# EAGLE schematic Rx_Nano_V2-1 (EAGLE 7.7.0)
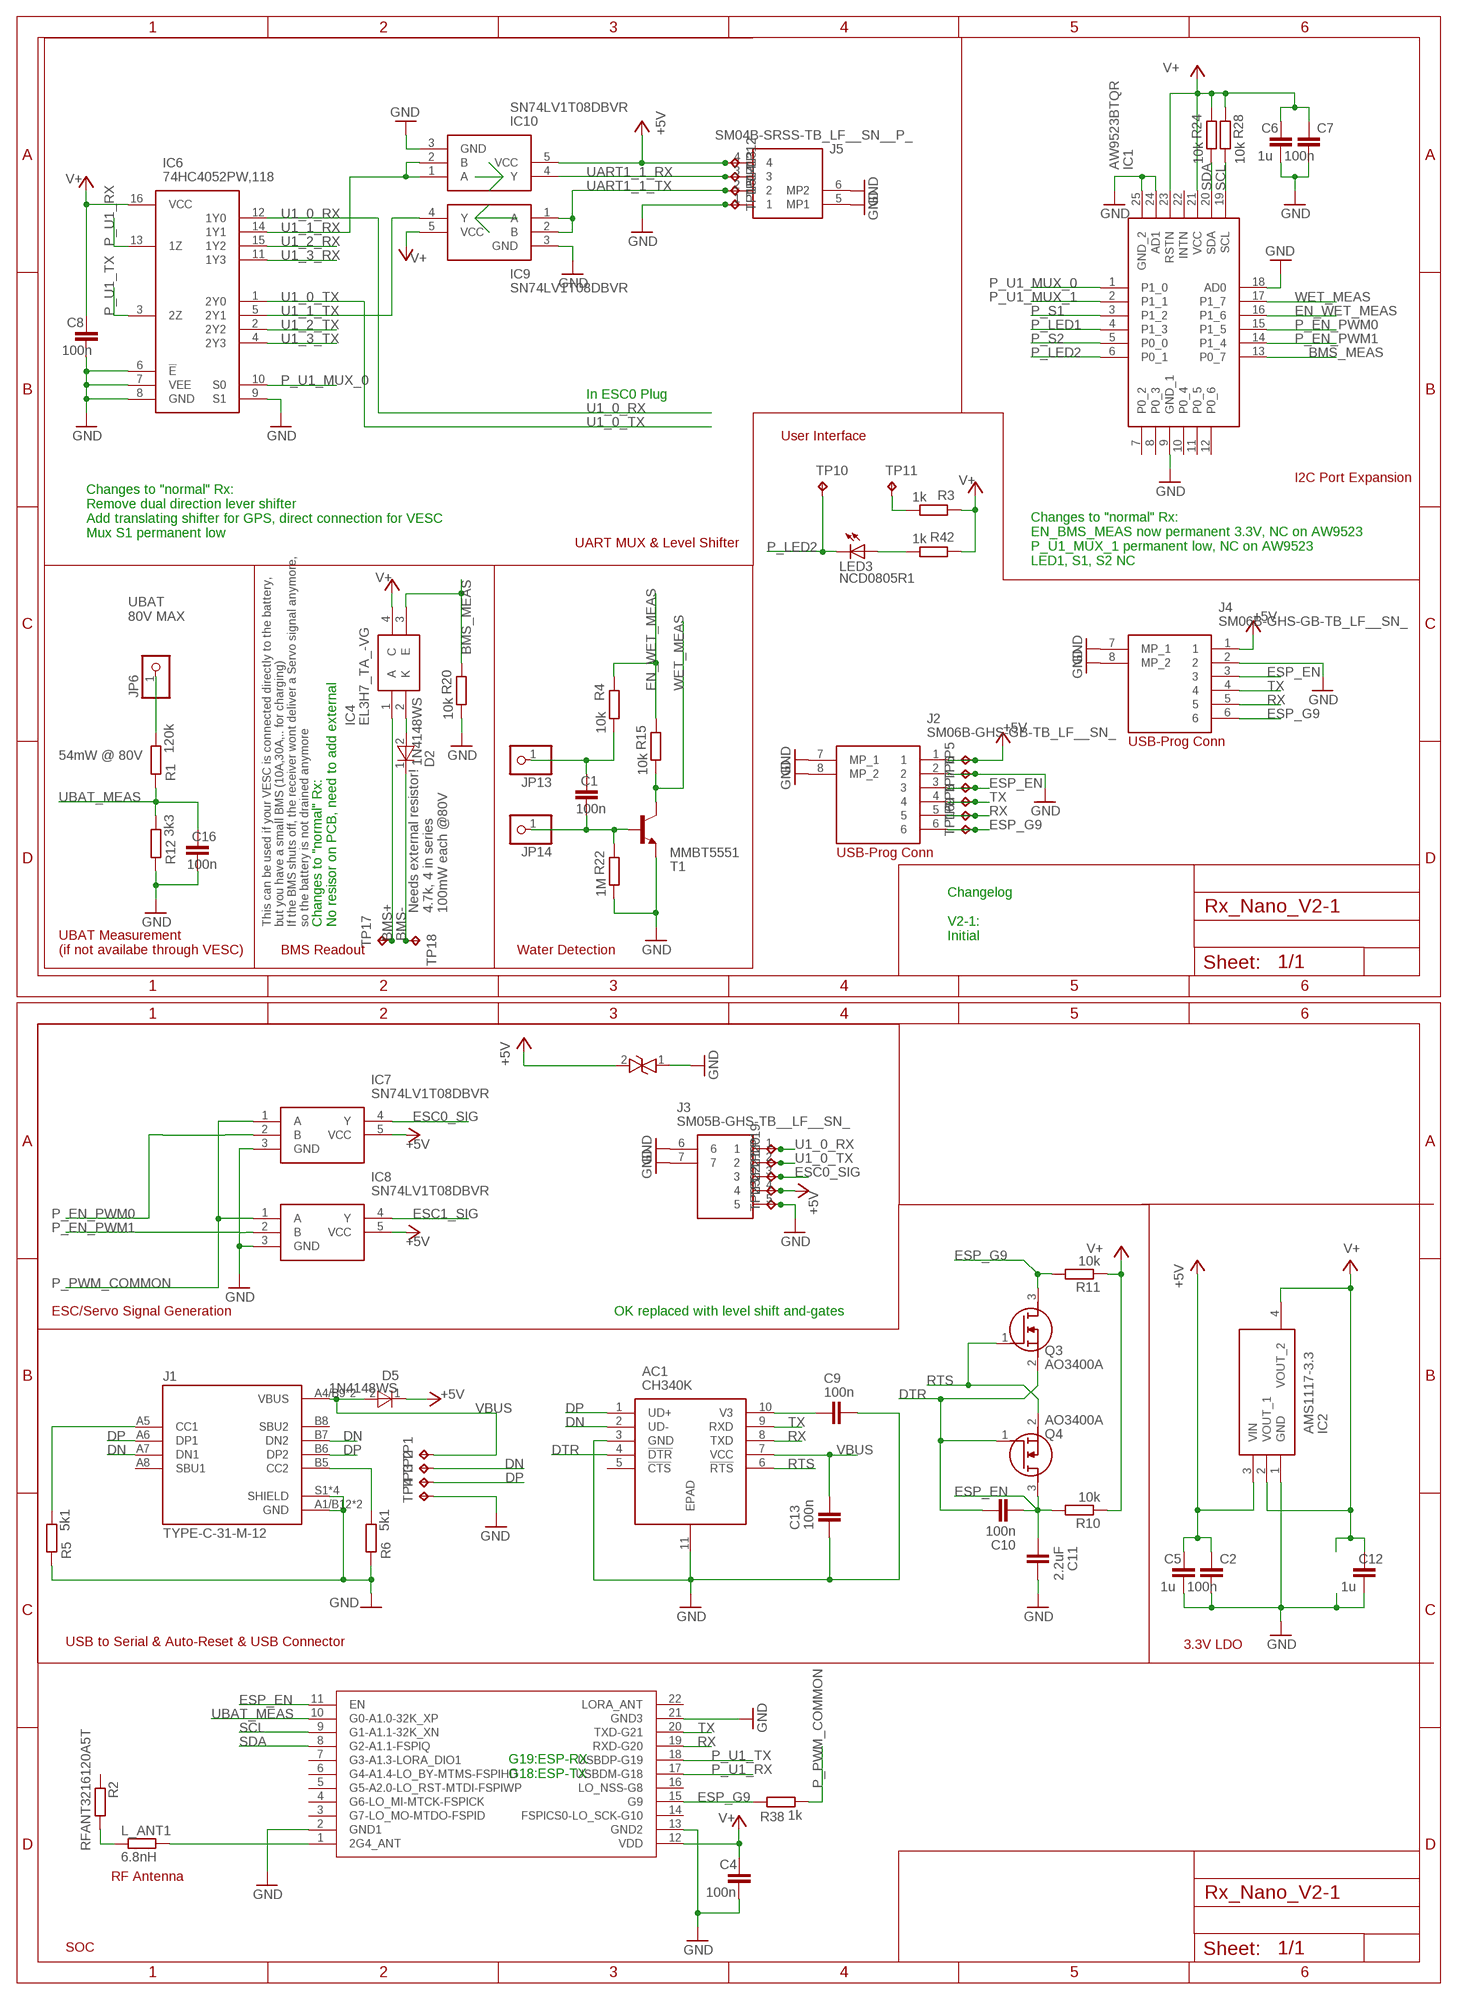
[diagram p0: schematic, sheet 1, part 1 of 2]
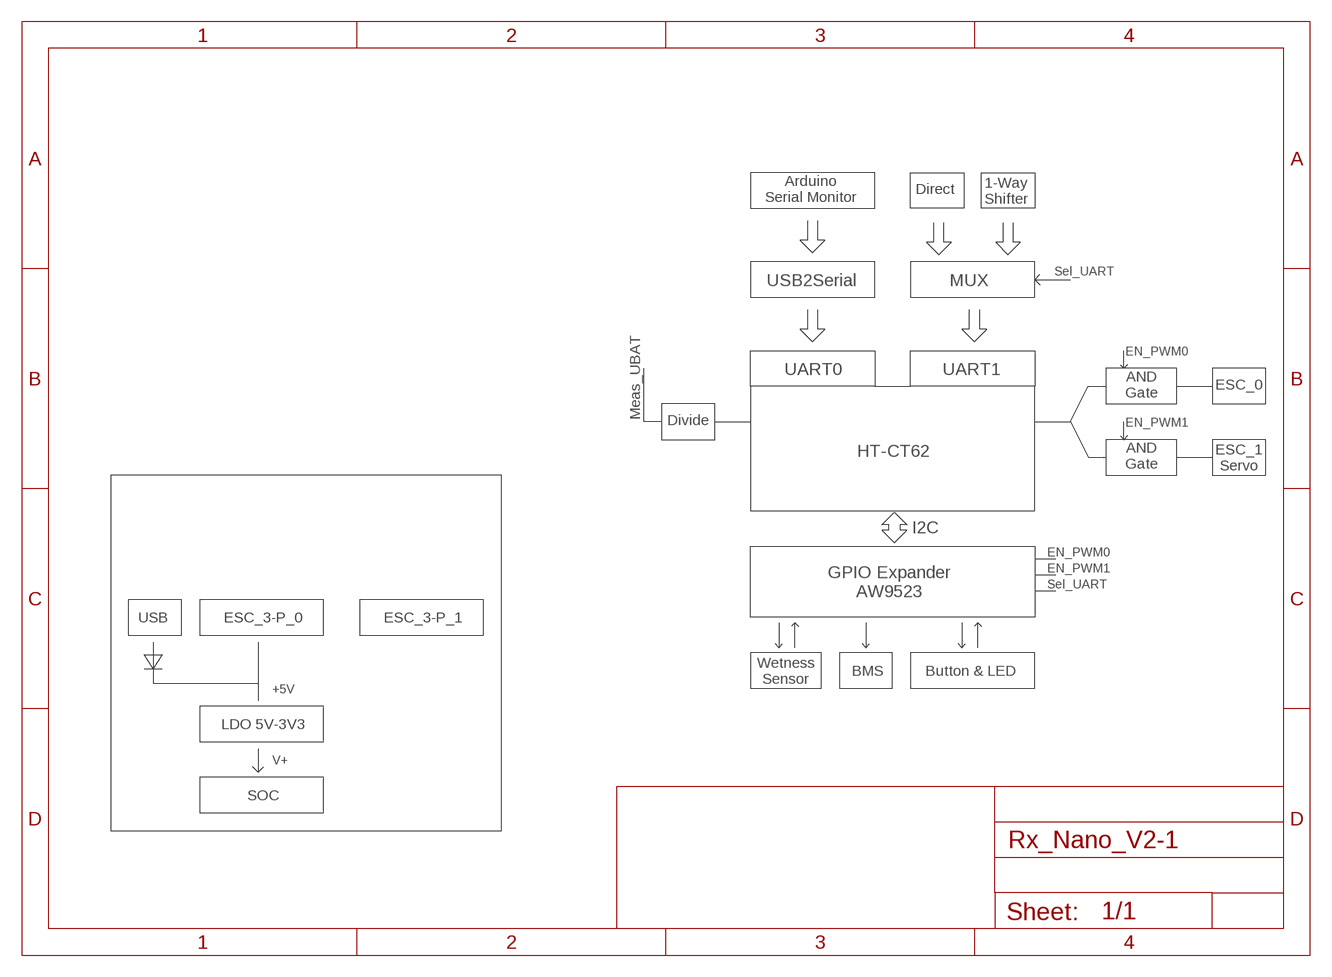
[diagram p1: schematic, sheet 1, part 2 of 2]

## Parts
AC1  CH340K  [SOP100P600X180-11N]
C1  100n  C-EUC0402  [C0402]
C2  100n  C-EUC0402  [C0402]
C4  100n  C-EUC0402  [C0402]
C5  1u  C-EUC0603  [C0603]
C6  1u  C-EUC0603  [C0603]
C7  100n  C-EUC0402  [C0402]
C8  100n  C-EUC0402  [C0402]
C9  100n  C-EUC0402  [C0402]
C10  100n  C-EUC0402  [C0402]
C11  2.2uF  C-EUC0603  [C0603]
C12  1u  C-EUC0603  [C0603]
C13  100n  C-EUC0402  [C0402]
C16  100n  C-EUC0402  [C0402]
D2  1N4148WS  [SODFL2512X90N]
D4  P6SMB6.8CA  [DIONM5436X261N]
D5  1N4148WS  [SODFL2512X90N]
IC1  AW9523BTQR  [QFN50P400X400X80-25N]
IC2  AMS1117-3.3  [SOT229P700X180-4N]
IC4  EL3H7_TA_-VG  [SOIC127P700X200-4N]
IC6  74HC4052PW,118  [SOP65P640X110-16N]
IC7  SN74LV1T08DBVR  [SOT95P280X145-5N]
IC8  SN74LV1T08DBVR  [SOT95P280X145-5N]
IC9  SN74LV1T08DBVR  [SOT95P280X145-5N]
IC10  SN74LV1T08DBVR  [SOT95P280X145-5N]
J1  TYPE-C-31-M-12  [HRO_TYPE-C-31-M-12]
J2  SM06B-GHS-GB-TB_LF__SN_  [SM06BGHSGBTBLFSN]
J3  SM05B-GHS-TB__LF__SN_  [SM05BGHSTBLFSN]
J4  SM06B-GHS-GB-TB_LF__SN_  [SM06BGHSGBTBLFSN]
J5  SM04B-SRSS-TB_LF__SN__P_  [SM04BSRSSTBLFSNP]
JP6  PINHD-1X1  [1X01]
JP13  PINHD-1X1  [1X01]
JP14  PINHD-1X1  [1X01]
L_ANT1  6.8nH  R-EU_R0402  [R0402]
LED3  NCD0805R1  LEDCHIP-LED0603  [CHIP-LED0603]
Q3  AO3400A  [SOT95P280X125-3N]
Q4  AO3400A  [SOT95P280X125-3N]
R1  120k  R-EU_R0603  [R0603]
R2  RFANT3216120A5T  R-EU_R1206  [R1206]
R3  1k  R-EU_R0402  [R0402]
R4  10k  R-EU_R0402  [R0402]
R5  5k1  R-EU_R0402  [R0402]
R6  5k1  R-EU_R0402  [R0402]
R10  10k  R-EU_R0402  [R0402]
R11  10k  R-EU_R0402  [R0402]
R12  3k3  R-EU_R0402  [R0402]
R15  10k  R-EU_R0402  [R0402]
R20  10k  R-EU_R0402  [R0402]
R22  1M  R-EU_R0402  [R0402]
R24  10k  R-EU_R0402  [R0402]
R28  10k  R-EU_R0402  [R0402]
R38  1k  R-EU_R0402  [R0402]
R42  1k  R-EU_R0402  [R0402]
T1  MMBT5551  BC847B-NPN-SOT23-BEC  [SOT23-BEC]
TP1  TPB1,27  [B1,27]
TP2  TPB1,27  [B1,27]
TP3  TPB1,27  [B1,27]
TP4  TPB1,27  [B1,27]
TP5  TPB1,27  [B1,27]
TP6  TPB1,27  [B1,27]
TP7  TPB1,27  [B1,27]
TP8  TPB1,27  [B1,27]
TP9  TPB1,27  [B1,27]
TP10  TPB1,27  [B1,27]
TP11  TPB1,27  [B1,27]
TP12  TPB1,27  [B1,27]
TP13  TPB1,27  [B1,27]
TP14  TPB1,27  [B1,27]
TP15  TPB1,27  [B1,27]
TP16  TPB1,27  [B1,27]
TP17  TPB1,27  [B1,27]
TP18  TPB1,27  [B1,27]
TP19  TPB1,27  [B1,27]
TP20  TPB1,27  [B1,27]
TP21  TPB1,27  [B1,27]
TP22  TPB1,27  [B1,27]
TP23  TPB1,27  [B1,27]
U$5  HT-CT62  [HT-CT62]

## Nets
+5V: C2.1 C5.1 D4.2 D5.1(K) IC2.3(VIN) IC7.5(VCC) IC8.5(VCC) IC10.5(VCC) J2.1 J3.4 J4.1 J5.4 TP5.TP TP12.TP TP22.TP
BMS+: IC4.1(A) TP17.TP
BMS-: D2.1(K) TP18.TP
BMS_MEAS: IC1.13(P0_7) IC4.3(E) R20.1
DN: AC1.2(UD-) J1.A7(DN1) J1.B7(DN2) TP2.TP
DP: AC1.1(UD+) J1.A6(DP1) J1.B6(DP2) TP3.TP
DTR: AC1.4(!DTR) C10.1 Q3.2(S) Q4.1(G)
EN_WET_MEAS: IC1.16(P1_6) R4.1 R15.1
ESC0_SIG: IC7.4(Y) J3.3 TP21.TP
ESC1_SIG: IC8.4(Y)
ESP_EN: C10.2 C11.2 J2.3 J4.3 Q4.3(D) R10.2 TP7.TP U$5.11(EN)
ESP_G9: J2.6 J4.6 Q3.3(D) R11.2 R38.1 TP16.TP U$5.15(G9)
GND: AC1.3(GND) AC1.11(EPAD) C2.2 C4.2 C5.2 C6.2 C7.2 C8.2 C9.1 C11.1 C12.2 C13.2 C16.2 D4.1 IC1.9(GND_1) IC1.18(AD0) IC1.24(AD1) IC1.25(GND_2) IC2.1(GND) IC6.6(!E) IC6.7(VEE) IC6.8(GND) IC6.9(S1) IC7.3(GND) IC8.3(GND) IC9.3(GND) IC10.3(GND) J1.A1/B12(GND) J1.B1/A12(GND) J1.S1(SHIELD) J1.S2(SHIELD) J1.S3(SHIELD) J1.S4(SHIELD) J2.2 J2.7(MP_1) J2.8(MP_2) J3.5 J3.6 J3.7 J4.2 J4.7(MP_1) J4.8(MP_2) J5.1 J5.5(MP1) J5.6(MP2) R5.1 R6.1 R12.1 R20.2 R22.2 T1.E TP4.TP TP6.TP TP15.TP TP23.TP U$5.2(GND1) U$5.13(GND2) U$5.21(GND3)
N$1: L_ANT1.2 R2.2
N$4: J1.A5(CC1) R5.2
N$6: L_ANT1.1 U$5.1(2G4_ANT)
N$7: LED3.A R42.2
N$8: R3.2 TP11.TP
N$10: J1.B5(CC2) R6.2
N$15: JP6.1 R1.2
N$16: D2.2(A) IC4.2(K)
N$17: C1.2 JP14.1 R22.1 T1.B
N$18: C1.1 JP13.1 R4.2
N$22: AC1.10(V3) C9.2
P_EN_PWM0: IC1.15(P1_5) IC7.2(B)
P_EN_PWM1: IC1.14(P1_4) IC8.2(B)
P_LED1: IC1.4(P1_3)
P_LED2: IC1.6(P0_1) LED3.C TP10.TP
P_PWM_COMMON: IC7.1(A) IC8.1(A) R38.2
P_S1: IC1.3(P1_2)
P_S2: IC1.5(P0_0)
P_U1_MUX_0: IC1.1(P1_0) IC6.10(S0)
P_U1_MUX_1: IC1.2(P1_1)
P_U1_RX: IC6.13(1Z) U$5.17(USBDM-G18)
P_U1_TX: IC6.3(2Z) U$5.18(USBDP-G19)
RTS: AC1.6(!RTS) Q3.1(G) Q4.2(S)
RX: AC1.8(TXD) J2.5 J4.5 TP9.TP U$5.19(RXD-G20)
SCL: IC1.19(SCL) R28.2 U$5.9(G1-A1.1-32K_XN)
SDA: IC1.20(SDA) R24.2 U$5.8(G2-A1.1-FSPIQ)
TX: AC1.9(RXD) J2.4 J4.4 TP8.TP U$5.20(TXD-G21)
U1_0_RX: IC6.12(1Y0) J3.1 TP19.TP
U1_0_TX: IC6.1(2Y0) J3.2 TP20.TP
U1_1_RX: IC6.14(1Y1) IC10.1(A) IC10.2(B)
U1_1_TX: IC6.5(2Y1) IC9.4(Y)
U1_2_RX: IC6.15(1Y2)
U1_2_TX: IC6.2(2Y2)
U1_3_RX: IC6.11(1Y3)
U1_3_TX: IC6.4(2Y3)
UART1_1_RX: IC10.4(Y) J5.3 TP13.TP
UART1_1_TX: IC9.1(A) IC9.2(B) J5.2 TP14.TP
UBAT_MEAS: C16.1 R1.1 R12.2 U$5.10(G0-A1.0-32K_XP)
V+: C4.1 C6.1 C7.1 C8.1 C12.1 IC1.21(VCC) IC1.23(RSTN) IC2.2(VOUT_1) IC2.4(VOUT_2) IC4.4(C) IC6.16(VCC) IC9.5(VCC) R3.1 R10.1 R11.1 R24.1 R28.1 R42.1 U$5.12(VDD)
VBUS: AC1.7(VCC) C13.1 D5.2(A) J1.A4/B9(VBUS) J1.B4/A9(VBUS) TP1.TP
WET_MEAS: IC1.17(P1_7) R15.2 T1.C
Unconnected: AC1.5(!CTS) IC1.7(P0_2) IC1.8(P0_3) IC1.10(P0_4) IC1.11(P0_5) IC1.12(P0_6) IC1.22(INTN) J1.A8(SBU1) J1.B8(SBU2) R2.1 U$5.3(G7-LO_MO-MTDO-FSPID) U$5.4(G6-LO_MI-MTCK-FSPICK) U$5.5(G5-A2.0-LO_RST-MTDI-FSPIWP) U$5.6(G4-A1.4-LO_BY-MTMS-FSPIHD) U$5.7(G3-A1.3-LORA_DIO1) U$5.14(FSPICS0-LO_SCK-G10) U$5.16(LO_NSS-G8) U$5.22(LORA_ANT)

## Notes on the sheet
- In ESC0 Plug
- User Interface
- I2C Port Expansion
- Changes to "normal" Rx:
  Remove dual direction lever shifter
  Add translating shifter for GPS, direct connection for VESC
  Mux S1 permanent low
- UART MUX & Level Shifter
- Changes to "normal" Rx:
  EN_BMS_MEAS now permanent 3.3V, NC on AW9523
  P_U1_MUX_1 permanent low, NC on AW9523
  LED1, S1, S2 NC
- UBAT
  80V MAX
- USB-Prog Conn
- 54mW @ 80V
- USB-Prog Conn
- Needs external resistor!
  4.7k, 4 in series
  100mW each @80V
- This can be used if your VESC is connected directly to the battery,
  but you have a small BMS (10A,30A,.. for charging)
  If the BMS shuts off, the receiver wont deliver a Servo signal anymore,
  so the battery is not drained anymore
- Changes to "normal" Rx:
  No resisor on PCB, need to add external
- Changelog
  
  V2-1:
  Initial
- UBAT Measurement
  (if not availabe through VESC)
- BMS Readout | Water Detection
- ESC/Servo Signal Generation | OK replaced with level shift and-gates
- USB to Serial & Auto-Reset & USB Connector | 3.3V LDO
- G19:ESP-RX
  G18:ESP-TX
- RF Antenna
- SOC
- Arduino
  Serial Monitor
- Direct
- 1-Way
  Shifter
- Sel_UART
- USB2Serial | MUX
- EN_PWM0
- Meas_UBAT | UART0 | UART1
- AND
  Gate
- ESC_0
- Divide
- EN_PWM1
- AND
  Gate
- HT-CT62
- ESC_1
  Servo
- I2C
- EN_PWM0
- EN_PWM1
- GPIO Expander
  AW9523
- Sel_UART
- USB | ESC_3-P_0 | ESC_3-P_1
- Wetness
  Sensor
- BMS | Button & LED
- +5V
- LDO 5V-3V3
- V+
- SOC

## Library data of the parts
AC1 = CH340K:CH340K: CH340 USB2Serial Source: Datasheet <https://akizukidenshi.com/download/ds/wch/ch340.pdf>; DESCRIPTION: CH340 USB2Serial; HEIGHT: 1.8mm; MANUFACTURER_NAME: WCH; MANUFACTURER_PART_NUMBER: CH340K
C1 C2 C4-C13 C16 = rcl:C-EU: CAPACITOR, European symbol
D2 D5 = 1N4148WS:1N4148WS: ON Semiconductor Switching Diode, 300mA 75V, 2-Pin SOD-323 1N4148WS Source: Datasheet; ARROW_PART_NUMBER: 1N4148WS; ARROW_PRICE-STOCK: https://www.arrow.com/en/products/1n4148ws/on-semiconductor?region=nac; DESCRIPTION: ON Semiconductor Switching Diode, 300mA 75V, 2-Pin SOD-323 1N4148WS; HEIGHT: 0.9mm; MANUFACTURER_NAME: onsemi; MANUFACTURER_PART_NUMBER: 1N4148WS; MOUSER_PART_NUMBER: 512-1N4148WS; MOUSER_PRICE-STOCK: https://www.mouser.co.uk/ProductDetail/ON-Semiconductor-Fairchild/1N4148WS?qs=2%2FYqgE%252BHg%252BKBrKZlAsMLhw%3D%3D
D4 = P6SMB6.8CA:P6SMB6.8CA: Littelfuse P6SMB6.8CA, Bi-Directional TVS Diode, 600W, 2-Pin DO-214AA Source: Datasheet <https://componentsearchengine.com/Datasheets/2/P6SMB6.8CA.pdf>; ARROW_PART_NUMBER: P6SMB6.8CA; ARROW_PRICE-STOCK: https://www.arrow.com/en/products/p6smb6.8ca/littelfuse?region=nac; DESCRIPTION: Littelfuse P6SMB6.8CA, Bi-Directional TVS Diode, 600W, 2-Pin DO-214AA; HEIGHT: 2.61mm; MANUFACTURER_NAME: LITTELFUSE; MANUFACTURER_PART_NUMBER: P6SMB6.8CA; MOUSER_PART_NUMBER: 576-P6SMB6.8CA; MOUSER_PRICE-STOCK: https://www.mouser.co.uk/ProductDetail/Littelfuse/P6SMB6.8CA?qs=3K5NeMAIBDkbaiJnSI65Ag%3D%3D
IC1 = AW9523BTQR:AW9523BTQR: 16 MULTI-FUNCTION LED DRIVER AND GPIO CONTROLLER WITH I2C INTERFACE Source: Datasheet <https://www.alldatasheet.net/datasheet-pdf/pdf/1148543/AWINIC/AW9523BTQR.html>; DESCRIPTION: 16 MULTI-FUNCTION LED DRIVER AND GPIO CONTROLLER WITH I2C INTERFACE; HEIGHT: 0.8mm; MANUFACTURER_NAME: AWINIC; MANUFACTURER_PART_NUMBER: AW9523BTQR
IC2 = AMS1117-3.3:AMS1117-3.3: 1A LOW DROPOUT VOLTAGE REGULATOR, SOT-223 Source: Datasheet <http://www.advanced-monolithic.com/pdf/ds1117.pdf>; DESCRIPTION: 1A LOW DROPOUT VOLTAGE REGULATOR, SOT-223; HEIGHT: 1.8mm; MANUFACTURER_NAME: Advanced Monolithic Systems; MANUFACTURER_PART_NUMBER: AMS1117-3.3
IC4 = EL3H7_TA_-VG:EL3H7_TA_-VG: Transistor Output Optocouplers 50-600CTR 3750Vrms -55 to +110 Op Temp Source: Datasheet <https://everlightamericas.com/index.php?controller=attachment&id_attachment=2584>; ARROW_PART_NUMBER: EL3H7(TA)-VG; ARROW_PRICE-STOCK: https://www.arrow.com/en/products/el3h7-ta-vg/everlight-electronics?region=nac; DESCRIPTION: Transistor Output Optocouplers 50-600CTR 3750Vrms -55 to +110 Op Temp; HEIGHT: 2mm; MANUFACTURER_NAME: Everlight; MANUFACTURER_PART_NUMBER: EL3H7(TA)-VG; MOUSER_PART_NUMBER: 638-EL3H7TAVG; MOUSER_PRICE-STOCK: https://www.mouser.co.uk/ProductDetail/Everlight/EL3H7TA-VG?qs=8PzhAHr7IdOgYIKe3kw%2F8Q%3D%3D
IC6 = 74HC4052PW_118:74HC4052PW,118: 74HC(T)4052 - Dual 4-channel analog multiplexer/demultiplexer@en-us Source: Datasheet <https://assets.nexperia.com/documents/data-sheet/74HC_HCT4052.pdf>; ARROW_PART_NUMBER: 74HC4052PW,118; ARROW_PRICE-STOCK: https://www.arrow.com/en/products/74hc4052pw118/nexperia?utm_currency=USD&region=nac; DESCRIPTION: 74HC(T)4052 - Dual 4-channel analog multiplexer/demultiplexer@en-us; HEIGHT: 1.1mm; MANUFACTURER_NAME: Nexperia; MANUFACTURER_PART_NUMBER: 74HC4052PW,118; MOUSER_PART_NUMBER: 771-74HC4052PW-T; MOUSER_PRICE-STOCK: https://www.mouser.co.uk/ProductDetail/Nexperia/74HC4052PW118?qs=P62ublwmbi%2Fhh72g3HnbZg%3D%3D
IC7-IC10 = SN74LV1T08DBVR:SN74LV1T08DBVR: Single power supply 2-input POSITIVE AND Gate with Logic Level Shifter Source: Datasheet <http://www.ti.com/lit/gpn/sn74lv1t08>; ARROW_PART_NUMBER: SN74LV1T08DBVR; ARROW_PRICE-STOCK: https://www.arrow.com/en/products/sn74lv1t08dbvr/texas-instruments?region=nac; DESCRIPTION: Single power supply 2-input POSITIVE AND Gate with Logic Level Shifter; HEIGHT: 1.45mm; MANUFACTURER_NAME: Texas Instruments; MANUFACTURER_PART_NUMBER: SN74LV1T08DBVR; MOUSER_PART_NUMBER: 595-SN74LV1T08DBVR; MOUSER_PRICE-STOCK: https://www.mouser.co.uk/ProductDetail/Texas-Instruments/SN74LV1T08DBVR?qs=igp4D3uu33L1GdLeA6GW0g%3D%3D
J1 = TYPE-C-31-M-12:TYPE-C-31-M-12: Check availability <https://pricing.snapeda.com/parts/TYPE-C-31-M-12/HRO%20Electronics%20Co.%2C%20Ltd./view-part?ref=eda>; AVAILABILITY: Not in stock; DESCRIPTION: USB Connectors 24 Receptacle 1 8.94*7.3mm RoHS; MF: HRO Electronics Co., Ltd.; MP: TYPE-C-31-M-12; PACKAGE: Package; PRICE: None
J2 J4 = SM06B-GHS-GB-TB_LF__SN_:SM06B-GHS-GB-TB_LF__SN_: Connector Header Surface Mount, Right Angle 6 position 0.049" (1.25mm) Source: Datasheet <https://www.jst-mfg.com/product/pdf/eng/eGH.pdf?671a6c73539b9>; DESCRIPTION: Connector Header Surface Mount, Right Angle 6 position 0.049" (1.25mm); HEIGHT: 4.35mm; MANUFACTURER_NAME: JST (JAPAN SOLDERLESS TERMINALS); MANUFACTURER_PART_NUMBER: SM06B-GHS-GB-TB(LF)(SN); MOUSER_PART_NUMBER: 306-SM06BGHSGBTBLFSN; MOUSER_PRICE-STOCK: https://www.mouser.co.uk/ProductDetail/JST-Commercial/SM06B-GHS-GB-TBLFSN?qs=QpmGXVUTftFuMHzTVLdLkw%3D%3D
J3 = SM05B-GHS-TB__LF__SN_:SM05B-GHS-TB__LF__SN_: CONN, R/A HDR, 5POS, 1ROW, 1.25MM, SMT; Source: Datasheet <https://datasheet.datasheetarchive.com/originals/distributors/Datasheets_SAMA/e4ef010dc292ea31091454f6c0afb63a.pdf>; DESCRIPTION: CONN, R/A HDR, 5POS, 1ROW, 1.25MM, SMT;; HEIGHT: 4.2mm; MANUFACTURER_NAME: JST (JAPAN SOLDERLESS TERMINALS); MANUFACTURER_PART_NUMBER: SM05B-GHS-TB (LF)(SN)
J5 = SM04B-SRSS-TB_LF__SN__P_:SM04B-SRSS-TB_LF__SN__P_: Connector Header Surface Mount, Right Angle 4 position 0.039" (1.00mm) Source: Datasheet <https://www.jst-mfg.com/product/pdf/eng/eSH.pdf>; DESCRIPTION: Connector Header Surface Mount, Right Angle 4 position 0.039" (1.00mm); HEIGHT: 2.95mm; MANUFACTURER_NAME: JST (JAPAN SOLDERLESS TERMINALS); MANUFACTURER_PART_NUMBER: SM04B-SRSS-TB(LF)(SN)(P); MOUSER_PART_NUMBER: 306-SM04BSRSSTBLFSNP; MOUSER_PRICE-STOCK: https://www.mouser.co.uk/ProductDetail/JST-Commercial/SM04B-SRSS-TBLFSNP?qs=QpmGXVUTftFkd0Wj%2F4g1ew%3D%3D
JP6 JP13 JP14 = pinhead:PINHD-1X1: PIN HEADER
L_ANT1 R1-R6 R10-R12 R15 R20 R22 R24 R28 R38 R42 = rcl:R-EU_: RESISTOR, European symbol
LED3 = led:LED: LED OSRAM: - CHIPLED LG R971, LG N971, LY N971, LG Q971, LY Q971, LO R971, LY R971 LH N974, LH R974 LS Q976, LO Q976, LY Q976 LO Q996 - Hyper CHIPLED LW Q18S LB Q993, LB Q99A, LB R99A - SideLED LS A670, LO A670, LY A670, LG A670, LP A670 LB A673, LV A673, LT A673, LW A673 LH A674 LY A675 LS A676, LA A676, LO A676, LY A676, LW A676 LS A679, LY A679, LG A679 - Hyper Micro SIDELED® LS Y876, LA Y876, LO Y876, LY Y876 LT Y87S - SmartLED LW L88C, LW L88S LB L89C, LB L89S, LG L890 LS L89K, LO L89K, LY L89K LS L896, LA L896, LO L896, LY L896 - TOPLED LS T670, LO T670, LY T670, LG T670, LP T670 LSG T670, LSP T670, LSY T670, LOP T670, LYG T670 LG T671, LOG T671, LSG T671 LB T673, LV T673, LT T673, LW T673 LH T674 LS T676, LA T676, LO T676, LY T676, LB T676, LH T676, LSB T676, LW T676 LB T67C, LV T67C, LT T67C, LS T67K, LO T67K, LY T67K, LW E67C LS E67B, LA E67B, LO E67B, LY E67B, LB E67C, LV E67C, LT E67C LW T67C LS T679, LY T679, LG T679 LS T770, LO T770, LY T770, LG T770, LP T770 LB T773, LV T773, LT T773, LW T773 LH T774 LS E675, LA E675, LY E675, LS T675 LS T776, LA T776, LO T776, LY T776, LB T776 LHGB T686 LT T68C, LB T68C - Hyper Mini TOPLED® LB M676 - Mini TOPLED Santana® LG M470 LS M47K, LO M47K, LY M47K Source: http://www.osram.convergy.de LUXEON: - LUMILED® LXK2-PW12-R00, LXK2-PW12-S00, LXK2-PW14-U00, LXK2-PW14-V00 LXK2-PM12-R00, LXK2-PM12-S00, LXK2-PM14-U00 LXK2-PE12-Q00, LXK2-PE12-R00, LXK2-PE12-S00, LXK2-PE14-T00, LXK2-PE14-U00 LXK2-PB12-K00, LXK2-PB12-L00, LXK2-PB12-M00, LXK2-PB14-N00, LXK2-PB14-P00, LXK2-PB14-Q00 LXK2-PR12-L00, LXK2-PR12-M00, LXK2-PR14-Q00, LXK2-PR14-R00 LXK2-PD12-Q00, LXK2-PD12-R00, LXK2-PD12-S00 LXK2-PH12-R00, LXK2-PH12-S00 LXK2-PL12-P00, LXK2-PL12-Q00, LXK2-PL12-R00 Source: www.luxeon.com KINGBRIGHT: KA-3528ASYC Source: www.kingbright.com
Q3 Q4 = AO3400A:AO3400A: 30V N-Channel MOSFET Source: Datasheet <http://aosmd.com/res/data_sheets/AO3400A.pdf>; ARROW_PART_NUMBER: AO3400A; ARROW_PRICE-STOCK: https://www.arrow.com/en/products/ao3400a/alpha-and-omega-semiconductor?region=nac; DESCRIPTION: 30V N-Channel MOSFET; HEIGHT: 1.25mm; MANUFACTURER_NAME: Alpha & Omega Semiconductors; MANUFACTURER_PART_NUMBER: AO3400A
T1 = transistor:*-NPN-: NPN Transistror BF959 corrected 2008.03.06
TP1-TP23 = testpad:TP: Test pad
U$5 = HT-CT62:HT-CT62